# EasyEDA schematic SCH_STM32平衡车_2024-11-28.json
TITLE: Sheet_1; REV: 1.0; Date: 2021-10-18; Sheet: 1/1; Drawn By: 张建宝; Company: Your Company
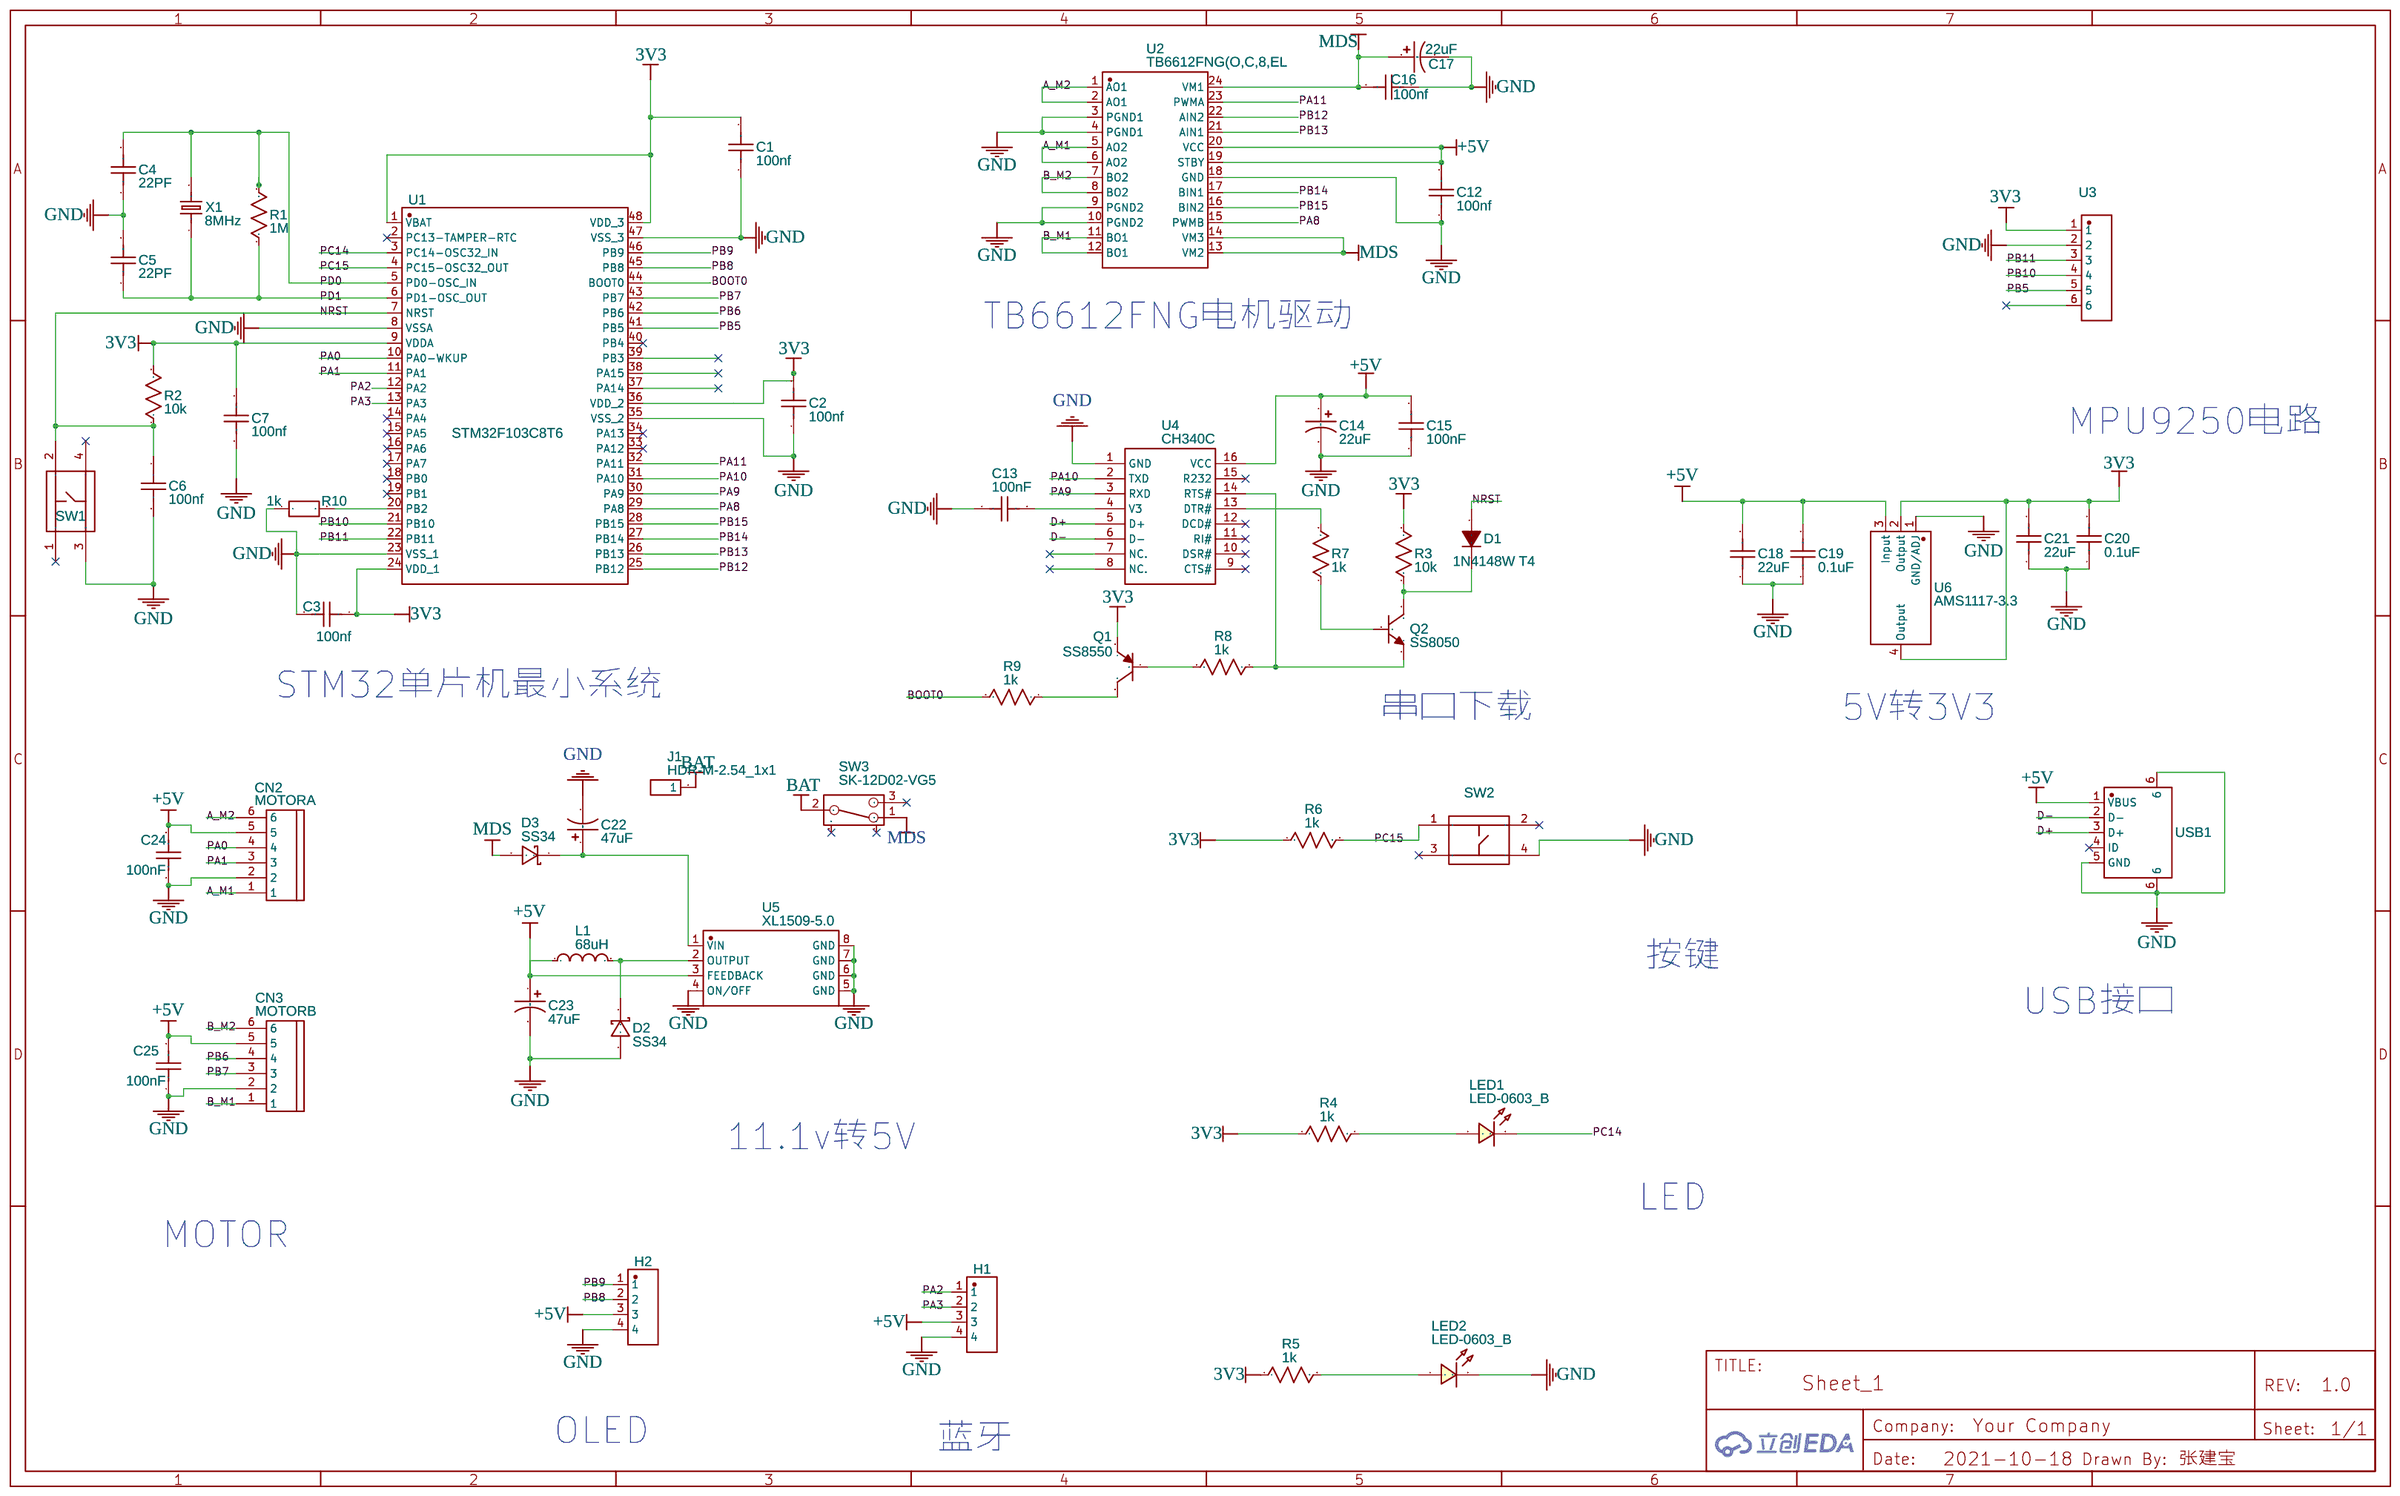
[diagram p0: schematic sheet]

## Parts
C1  100nf  [C0805]
C2  100nf  [C0805]
C3  100nf  [C0805]
C4  22PF  [C0603]
C5  22PF  [C0603]
C6  100nf  [C0805]
C7  100nf  [C0805]
C12  100nf  [C0805]
C13  100nF  [C0805]
C14  22uF  [CASE-A_3216]
C15  100nF  [C0805]
C16  100nf  [C0805]
C17  22uF  [CASE-A_3216]
C18  22uF  [C0805]
C19  0.1uF  [C0805]
C20  0.1uF  [C0805]
C21  22uF  [C0805]
C22  47uF  [CASE-A_3216]
C23  47uF  [CASE-A_3216]
C24  100nF  [C0805]
C25  100nF  [C0805]
CN2  MOTORA  [CONN-TH_XH-6AW]
CN3  MOTORB  [CONN-TH_XH-6AW]
D1  1N4148W T4  [SOD-123_L2.8-W1.8-LS3.7-RD]
D2  SS34  [SMA_L4.4-W2.6-LS5.0-RD]
D3  SS34  [SMA_L4.4-W2.6-LS5.0-RD]
H1  2.54-1*4P母  [HDR-TH_4P-P2.54-V-F]
H2  2.54-1*4P母  [HDR-TH_4P-P2.54-V-F]
J1  HDR-M-2.54_1x1  [HDR-M-2.54_1X1]
L1  68uH  [IND-SMD_L12.5-W12.5]
LED1  LED-0603_B  [LED0603_BLUE]
LED2  LED-0603_B  [LED0603_BLUE]
Q1  SS8550  [SOT-23-3_L2.9-W1.3-P1.90-LS2.4-BR]
Q2  SS8050  [SOT-23-3_L2.9-W1.3-P1.90-LS2.4-BR]
R1  1M  [R0805]
R2  10k  [R0805]
R3  10k  [R0805]
R4  1k  [R0805]
R5  1k  [R0805]
R6  1k  [R0805]
R7  1k  [R0805]
R8  1k  [R0805]
R9  1k  [R0805]
R10  1k  [R0603]
SW1  K2-1102DP-C4SW-04  [KEY-TH_4P-L6.0-W6.0-P4.50-LS6.5]
SW2  K2-1102DP-C4SW-04  [KEY-TH_4P-L6.0-W6.0-P4.50-LS6.5]
SW3  SK-12D02-VG5  [SW-TH_SK-12D02-VG5]
U1  STM32F103C8T6  [LQFP-48_L7.0-W7.0-P0.50-LS9.0-BL]
U2  TB6612FNG(O,C,8,EL  [SSOP-24_L8.4-W5.8-P0.65-LS7.8-BL]
U3  A2541HWV-6P_C2897443  [HDR-TH_6P-P2.54-V-F]
U4  CH340C  [SOP-16_L10.0-W3.9-P1.27-LS6.0-BL]
U5  XL1509-5.0  [SOIC-8_L4.9-W3.9-P1.27-LS6.0-TR]
U6  AMS1117-3.3  [SOT-223-4_L6.5-W3.5-P2.30-LS7.0-BR]
USB1  U-M-M5DS-W-5_C2689963  [MINI-USB-SMD_U-M-M5DS-W-5]
X1  8MHz  [HC-49US_L11.5-W4.5-P4.88]

## Library data of the parts
C1-C3 C6 C7 C12 C13 C15 C16 C18-C21 C24 C25 = C_0805_US: Contributor: LCEDA_Lib
C4 C5 = C_0603_US: Contributor: LCEDA_Lib
C14 C17 C22 C23 = C_Tan_SMD_A_US: Contributor: LCEDA_Lib
CN2 CN3 = XH-6AW_C8876: Supplier: LCSC; Manufacturer: BOOMELE; Manufacturer Part: XH-6AW; Supplier Part: C8876; JLCPCB Part Class: Extended Part
D1 = 1N4148W T4: Supplier: LCSC; Manufacturer: CJ; Supplier Part: C2099; Contributor: 立创EDA官方封装库; JLCPCB Part Class: Extended Part
D2 D3 = SS34_C466502: Supplier: LCSC; Supplier Part: C466502; Manufacturer: High Diode; Contributor: LCSC
H1 H2 = 2.54-1*4P母: Supplier: LCSC; Supplier Part: C2718488; Manufacturer: BOOMELE(博穆精密); Contributor: LCSC; JLCPCB Part Class: Extended Part
J1 = HDR-M-2.54_1x1: Supplier Part: C81276; Supplier: LCSC; Contributor: LCEDA_Lib
L1 = SLH1207S680MTT: Supplier: LCSC; Supplier Part: C182146; Manufacturer: Sunltech Tech; Contributor: LCSC; JLCPCB Part Class: Extended Part
LED1 LED2 = LED-0603_B: Manufacturer: EVERLIGHT(台湾亿光); Manufacturer Part: 19-217/BHC-ZL1M2RY/3T; Supplier Part: C72041; Supplier: LCSC; Contributor: LCEDA_01
Q1 = SS8550_C2762207: Supplier: LCSC; Supplier Part: C2762207; Manufacturer: 晶导微电子; Contributor: LCSC; JLCPCB Part Class: Extended Part
Q2 = SS8050_C541705: Supplier: LCSC; Supplier Part: C541705; Manufacturer: AnBon; Contributor: LCSC; JLCPCB Part Class: Extended Part
R1-R9 = R_0805_US: Contributor: LCEDA_Lib
R10 = R_0603_EU: Contributor: LCEDA_Lib
SW1 SW2 = K2-1102DP-C4SW-04: Supplier: LCSC; Manufacturer: HRO; Contributor: LCSC; Supplier Part: C110153; JLCPCB Part Class: Extended Part
SW3 = SK-12D02-VG5: Supplier: LCSC; Supplier Part: C136722; Manufacturer: Rectangular Connectors - Contacts; Contributor: LCSC; JLCPCB Part Class: Extended Part
U1 = STM32F103C8T6: Supplier: LCSC; Manufacturer: STMicroelectronics; Supplier Part: C8734; JLCPCB Part Class: Basic Part
U2 = TB6612FNG(O,C,8,EL: Supplier: LCSC; Manufacturer: TOSHIBA; Supplier Part: C88224; JLCPCB Part Class: Extended Part
U3 = A2541HWV-6P_C2897443: Supplier: LCSC; Supplier Part: C2897443; Manufacturer: CJT(长江连接器); Manufacturer Part: A2541HWV-6P; Contributor: LCSC
U4 = CH340C: Supplier: LCSC; Manufacturer: WCH; Supplier Part: C84681; JLCPCB Part Class: Extended Part
U5 = XL1509-5.0_C2902368: Supplier: LCSC; Supplier Part: C2902368; Manufacturer: UMW(友台半导体); JLCPCB Part Class: Extended Part; Contributor: LCSC
U6 = AMS1117-3.3_C369933: Supplier: LCSC; Supplier Part: C369933; Manufacturer: KEXIN; Contributor: LCSC; JLCPCB Part Class: Extended Part
USB1 = U-M-M5DS-W-5_C2689963: Supplier: LCSC; Supplier Part: C2689963; Manufacturer: 韩国韩荣; Manufacturer Part: U-M-M5DS-W-5; Contributor: LCSC; JLCPCB Part Class: Extended Part
X1 = 49S-8.000-20-20-20/A: Supplier: LCSC; Supplier Part: C240916; Manufacturer: Suzhou Liming Elec; Contributor: LCSC; JLCPCB Part Class: Extended Part

## Nets
3V3: C1.2 C2.2 C3.1 C7.1 C20.2 C21.2 Q1.2(E) R2.2 R3.2 R4.1 R5.1 R6.1 U1.1(VBAT) U1.9(VDDA) U1.24(VDD_1) U1.36(VDD_2) U1.48(VDD_3) U3.1 U6.2(Output) U6.4(Output)
+5V: C12.2 C14.1 C15.2 C18.2 C19.2 C23.1 C24.2 C25.2 CN2.5 CN3.5 H1.3 H2.3 L1.1 U2.19(STBY) U2.20(VCC) U4.16(VCC) U5.3(FEEDBACK) U6.3(Input) USB1.1(VBUS)
GND: C1.1 C2.1 C3.2 C4.1 C5.2 C6.2 C7.2 C12.1 C13.1 C14.2 C15.1 C16.1 C17.2 C18.1 C19.1 C20.1 C21.1 C22.2 C23.2 C24.1 C25.1 CN2.2 CN3.2 D2.2 H1.4 H2.4 LED2.2 R10.1 SW1.3 SW2.4 U1.8(VSSA) U1.23(VSS_1) U1.35(VSS_2) U1.47(VSS_3) U2.3(PGND1) U2.4(PGND1) U2.9(PGND2) U2.10(PGND2) U2.18(GND) U3.2 U4.1(GND) U5.4(ON/OFF) U5.5(GND) U5.6(GND) U5.7(GND) U5.8(GND) U6.1(GND/ADJ) USB1.5(GND) USB1.6
A_M1: CN2.1 U2.5(AO2) U2.6(AO2)
A_M2: CN2.6 U2.1(AO1) U2.2(AO1)
B_M1: CN3.1 U2.11(BO1) U2.12(BO1)
B_M2: CN3.6 U2.7(BO2) U2.8(BO2)
BAT: J1.1 SW3.2
BOOT0: R9.2 U1.44(BOOT0)
D+: U4.5(D+) USB1.3(D+)
D-: U4.6(D-) USB1.2(D-)
MDS: C16.2 C17.1 D3.2 SW3.1 U2.13(VM2) U2.14(VM3) U2.24(VM1)
NRST: C6.1 D1.2(A) R2.1 SW1.2 U1.7(NRST)
PA0: CN2.4 U1.10(PA0-WKUP)
PA1: CN2.3 U1.11(PA1)
PA2: H1.1 U1.12(PA2)
PA3: H1.2 U1.13(PA3)
PA8: U1.29(PA8) U2.15(PWMB)
PA9: U1.30(PA9) U4.3(RXD)
PA10: U1.31(PA10) U4.2(TXD)
PA11: U1.32(PA11) U2.23(PWMA)
PB5: U1.41(PB5) U3.5
PB6: CN3.4 U1.42(PB6)
PB7: CN3.3 U1.43(PB7)
PB8: H2.2 U1.45(PB8)
PB9: H2.1 U1.46(PB9)
PB10: U1.21(PB10) U3.4
PB11: U1.22(PB11) U3.3
PB12: U1.25(PB12) U2.22(AIN2)
PB13: U1.26(PB13) U2.21(AIN1)
PB14: U1.27(PB14) U2.17(BIN1)
PB15: U1.28(PB15) U2.16(BIN2)
PC14: LED1.2 U1.3(PC14-OSC32_IN)
PC15: R6.2 SW2.1 U1.4(PC15-OSC32_OUT)
PD0: C4.2 R1.2 U1.5(PD0-OSC_IN) X1.2
PD1: C5.1 R1.1 U1.6(PD1-OSC_OUT) X1.1
Net-(C13-2): C13.2 U4.4(V3)
Net-(C22-1): C22.1 D3.1 U5.1(VIN)
Net-(D1-1): D1.1(K) Q2.3(C) R3.1
Net-(D2-1): D2.1 L1.2 U5.2(OUTPUT)
Net-(LED1-1): LED1.1 R4.2
Net-(LED2-1): LED2.1 R5.2
Net-(Q1-1): Q1.1(B) R8.2
Net-(Q1-3): Q1.3(C) R9.1
Net-(Q2-1): Q2.1(B) R7.1
Net-(Q2-2): Q2.2(E) R8.1 U4.14(RTS#)
Net-(R7-2): R7.2 U4.13(DTR#)
Net-(R10-2): R10.2 U1.20(PB2)

Not connected (* = marked no-connect by the designer): SW1 1* 4*; SW2 2* 3*; SW3 3* 4* 5*; U1 2(PC13-TAMPER-RTC)* 14(PA4)* 15(PA5)* 16(PA6)* 17(PA7)* 18(PB0)* 19(PB1)* 33(PA12)* 34(PA13)* 37(PA14) 38(PA15) 39(PB3) 40(PB4)*; U3 6; U4 7(NC.) 8(NC.) 9(CTS#)* 10(DSR#)* 11(RI#)* 12(DCD#)* 15(R232)*; USB1 4(ID)*

## Notes on the sheet
- TB6612FNG电机驱动
- MPU9250电路
- STM32单片机最小系统
- 串口下载
- 5V转3V3
- 按键
- USB接口
- 11.1v转5V
- LED
- MOTOR
- OLED
- 蓝牙
